# EAGLE design ST40-JTAG (EAGLE 6.5.0)
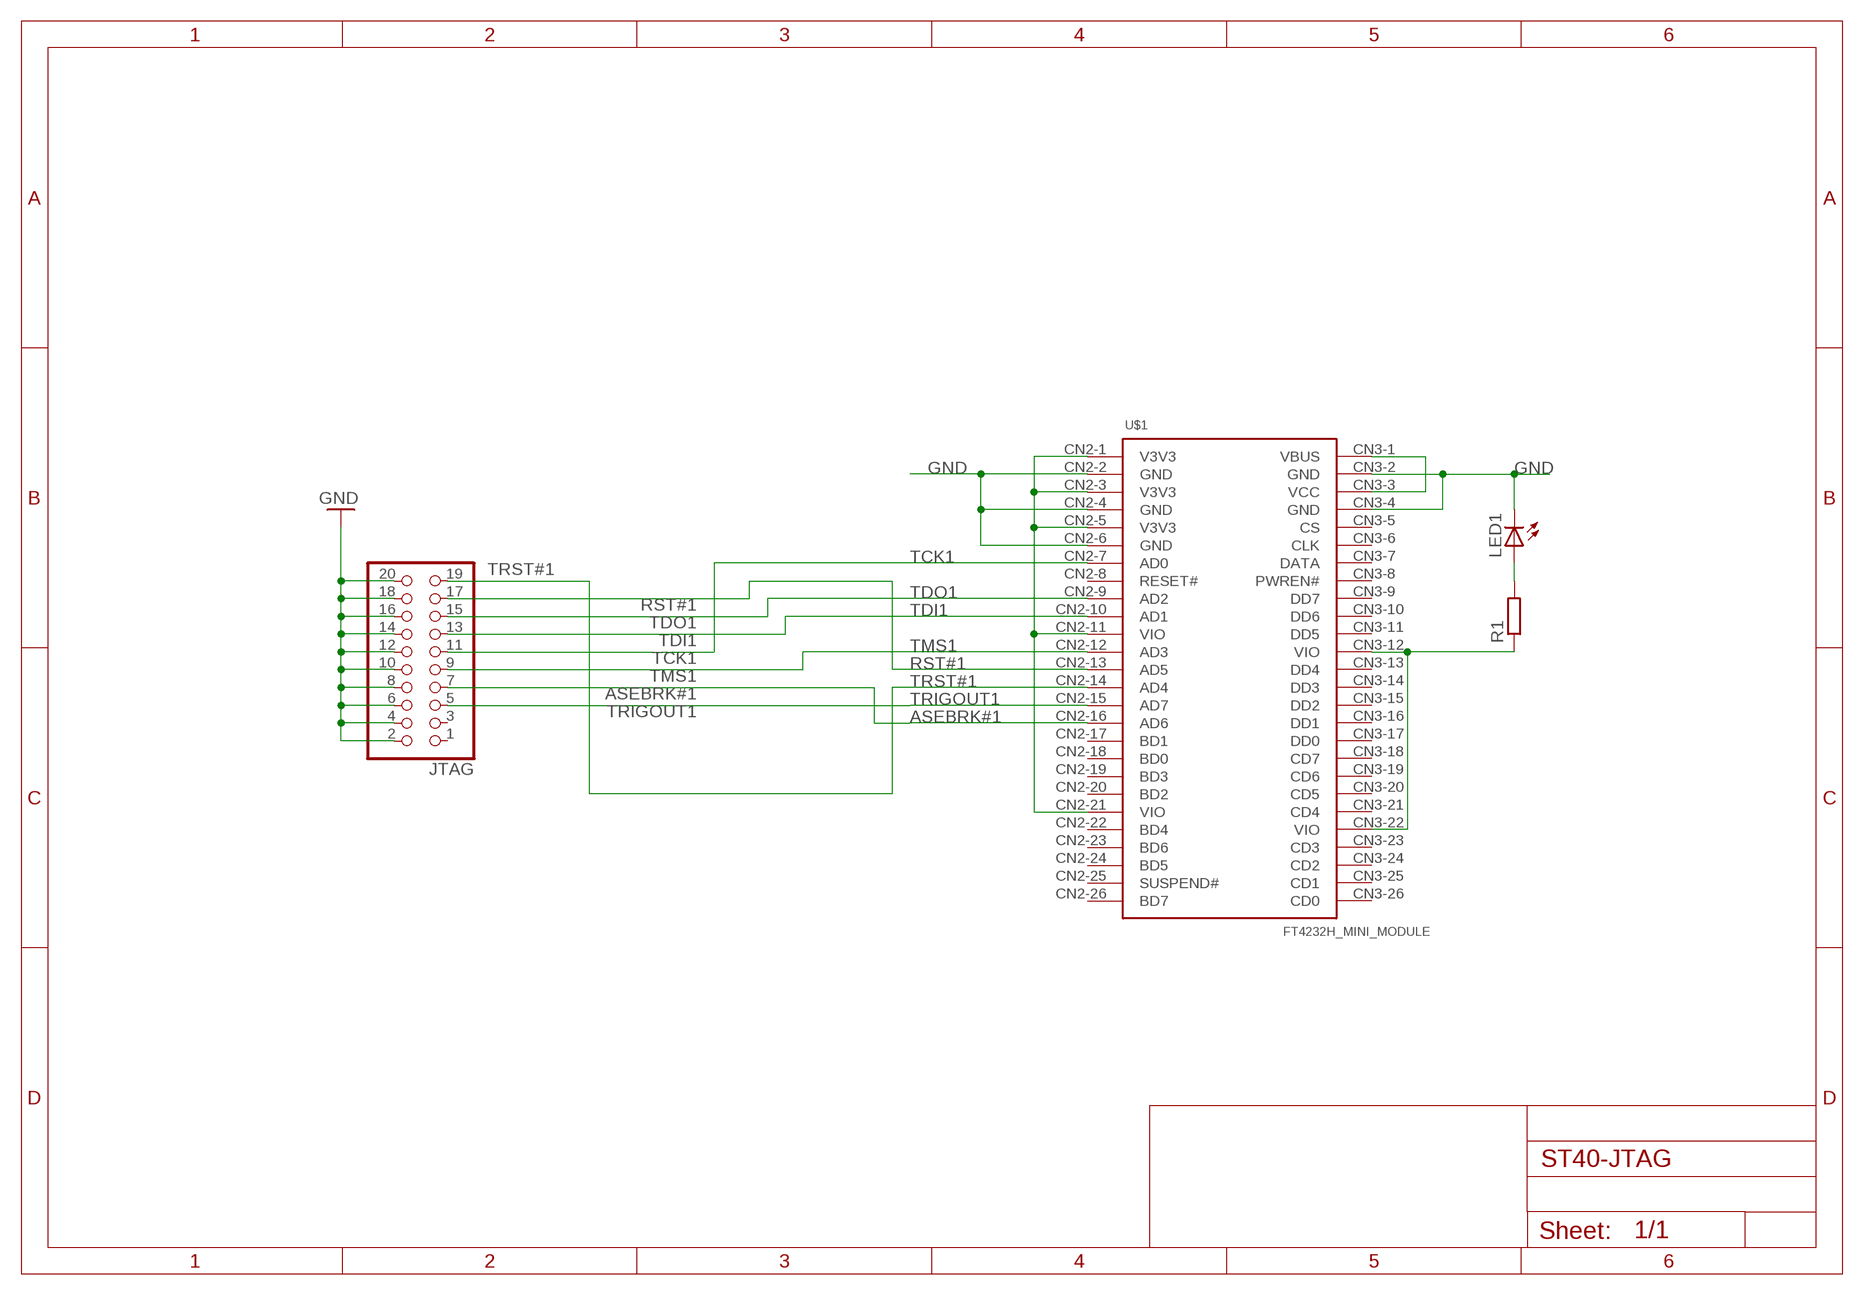
[diagram p0: schematic, sheet 1]

## Parts
JTAG  PINHD-2X10  [2X10]
LED1  LED1206  [LED-1206]
R1  R-EU_M0805  [M0805]
U$1  FT4232H_MINI_MODULE  [PINHEAD]

## Nets
ASEBRK#1: JTAG.7 U$1.CN2-16(AD6)
GND: JTAG.2 JTAG.4 JTAG.6 JTAG.8 JTAG.10 JTAG.12 JTAG.14 JTAG.16 JTAG.18 JTAG.20 LED1.C U$1.CN2-2(GND) U$1.CN2-4(GND) U$1.CN2-6(GND) U$1.CN3-2(GND) U$1.CN3-4(GND)
N$1: U$1.CN3-1(VBUS) U$1.CN3-3(VCC)
N$2: U$1.CN2-1(V3V3) U$1.CN2-3(V3V3) U$1.CN2-5(V3V3) U$1.CN2-11(VIO)
N$3: R1.1 U$1.CN3-12(VIO) U$1.CN3-22(VIO)
N$4: LED1.A R1.2
RST#1: JTAG.17 U$1.CN2-13(AD5)
TCK1: JTAG.11 U$1.CN2-7(AD0)
TDI1: JTAG.13 U$1.CN2-10(AD1)
TDO1: JTAG.15 U$1.CN2-9(AD2)
TMS1: JTAG.9 U$1.CN2-12(AD3)
TRIGOUT1: JTAG.5 U$1.CN2-15(AD7)
TRST#1: JTAG.19 U$1.CN2-14(AD4)
Unconnected: JTAG.1 JTAG.3 U$1.CN2-8(RESET#) U$1.CN2-17(BD1) U$1.CN2-18(BD0) U$1.CN2-19(BD3) U$1.CN2-20(BD2) U$1.CN2-21(VIO) U$1.CN2-22(BD4) U$1.CN2-23(BD6) U$1.CN2-24(BD5) U$1.CN2-25(SUSPEND#) U$1.CN2-26(BD7) U$1.CN3-5(CS) U$1.CN3-6(CLK) U$1.CN3-7(DATA) U$1.CN3-8(PWREN#) U$1.CN3-9(DD7) U$1.CN3-10(DD6) U$1.CN3-11(DD5) U$1.CN3-13(DD4) U$1.CN3-14(DD3) U$1.CN3-15(DD2) U$1.CN3-16(DD1) U$1.CN3-17(DD0) U$1.CN3-18(CD7) U$1.CN3-19(CD6) U$1.CN3-20(CD5) U$1.CN3-21(CD4) U$1.CN3-23(CD3) U$1.CN3-24(CD2) U$1.CN3-25(CD1) U$1.CN3-26(CD0)

## Library data of the parts
JTAG = pinhead:PINHD-2X10: PIN HEADER
LED1 = SparkFun-LED:LED: LEDs Standard schematic elements and footprints for 5mm, 3mm, 1206, and 0603 sized LEDs. 5mm - Spark Fun Electronics SKU : COM-00529 (and others)
R1 = resistor:R-EU_: RESISTOR, European symbol
U$1 = ft4232H_mini_module:FT4232H_MINI_MODULE

## Board
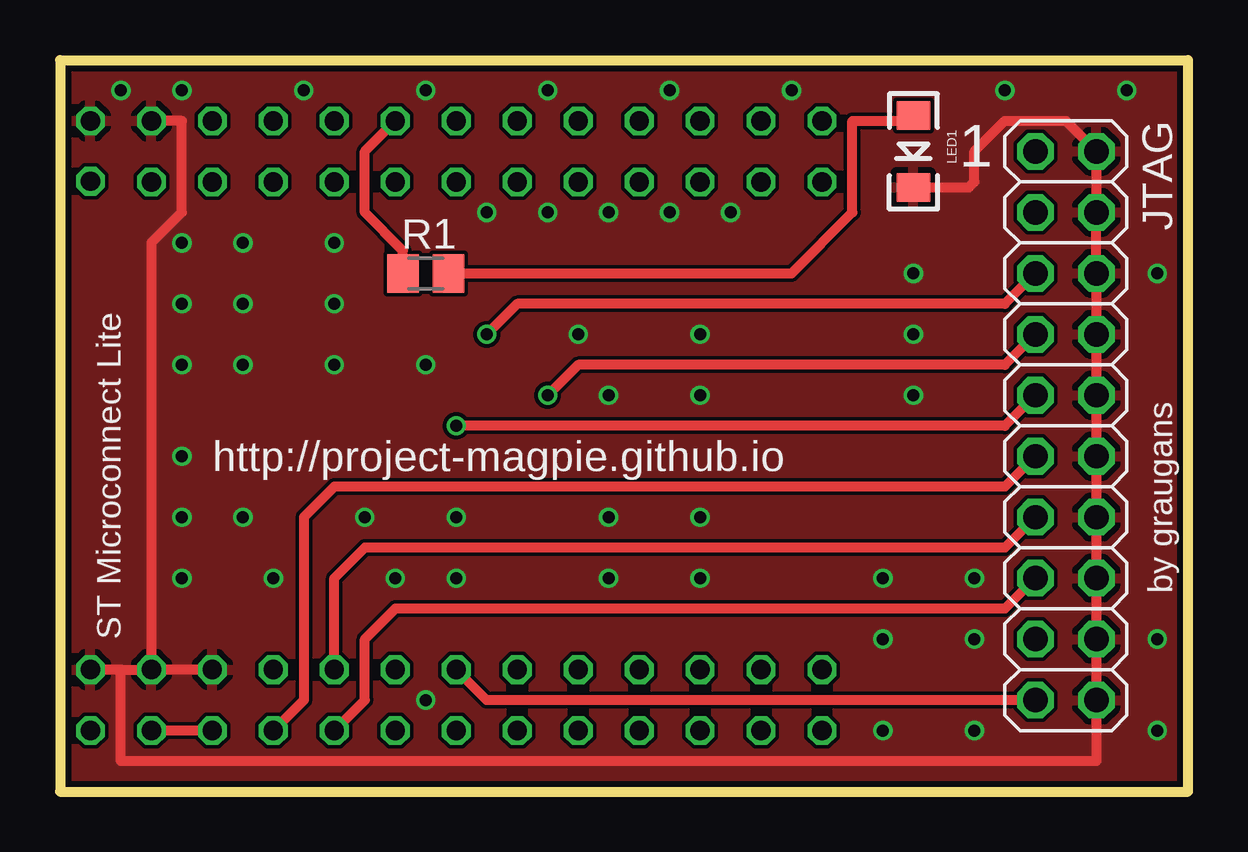
[diagram p1: board, top side]
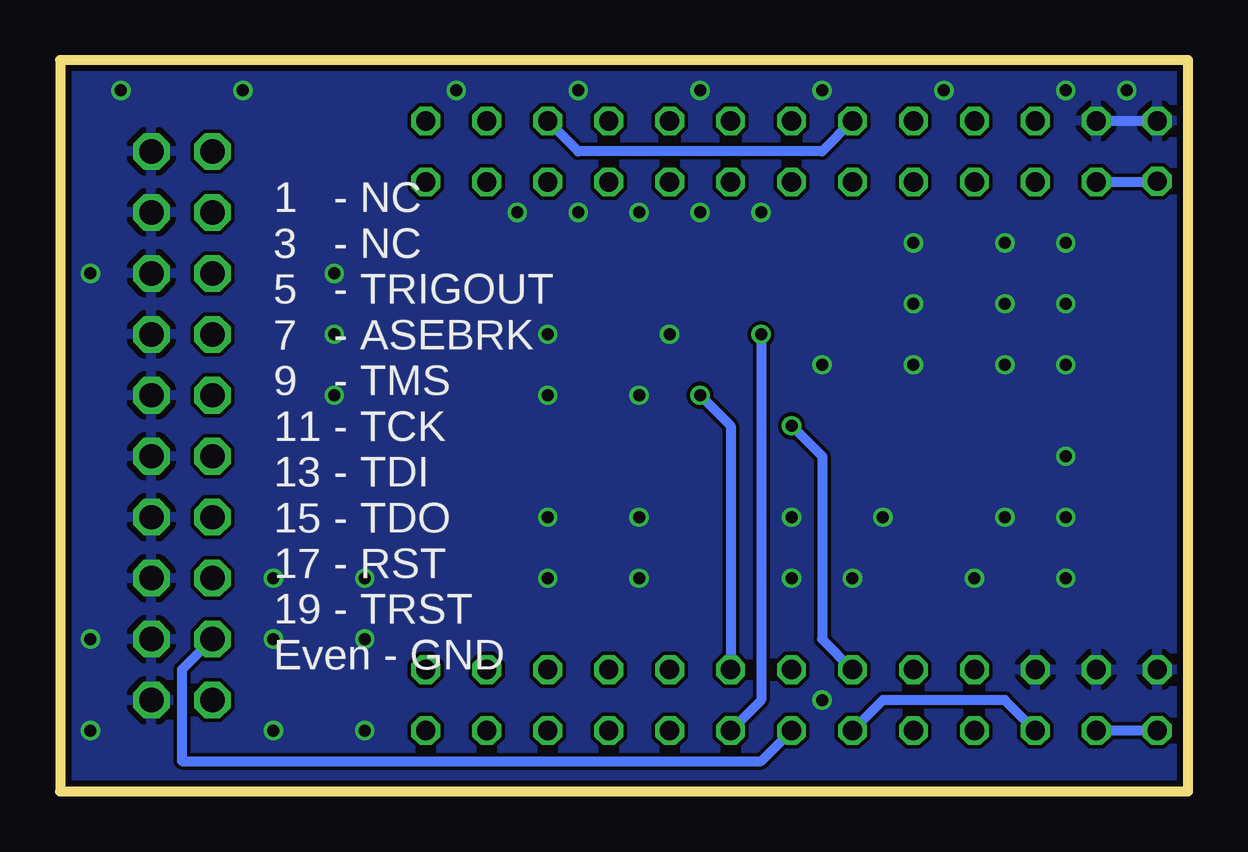
[diagram p2: board, bottom side, seen from below]

Size 46.99 x 30.48 mm. Coordinates in mm from the lower left corner, seen from the top.
Outline: 0,30.48 0,0 46.99,0 46.99,30.48 0,30.48
Copper layers (1*2*15*16): Top 0.035mm / dielectric 0.2mm / Route2 0.0175mm / dielectric 1.1mm / Route15 0.0175mm / dielectric 0.2mm / Bottom 0.035mm
Design rules "SeeedStudio_DRU_no_angle_20130527": minimum track width 6mil, minimum drill 12mil, track to track 6mil, track to pad 6mil, pad to pad 6mil, via to via 6mil, smd to smd 0mil, copper to edge 10mil, drill to drill 10mil, minimum pad ring 6mil, minimum via ring 6mil, stop-mask expansion 2mil, vias tented up to drill 25mil, thermal gap 10mil

### Footprints (pad centres in the part's own frame; a part is rotated, then mirrored left to right if it is on the bottom)
2X10 = drill 1.016 octagon: 1 -11.43,-1.27; 2 -11.43,1.27; 3 -8.89,-1.27; 4 -8.89,1.27; 5 -6.35,-1.27; 6 -6.35,1.27; 7 -3.81,-1.27; 8 -3.81,1.27; 9 -1.27,-1.27; 10 -1.27,1.27; 11 1.27,-1.27; 12 1.27,1.27; 13 3.81,-1.27; 14 3.81,1.27; 15 6.35,-1.27; 16 6.35,1.27; 17 8.89,-1.27; 18 8.89,1.27; 19 11.43,-1.27; 20 11.43,1.27
LED-1206 = smd 1.2 x 1.4: A -1.5,0; C 1.5,0
M0805 = smd 1.3 x 1.6: 1 -0.95,0; 2 0.95,0
PINHEAD = drill 0.8 octagon: CN2-1 -12.7,12.7; CN2-2 -10.16,12.7; CN2-3 -12.7,10.16; CN2-4 -10.16,10.16; CN2-5 -12.7,7.62; CN2-6 -10.16,7.62; CN2-7 -12.7,5.08; CN2-8 -10.16,5.08; CN2-9 -12.7,2.54; CN2-10 -10.16,2.54; CN2-11 -12.7,0; CN2-12 -10.16,0; CN2-13 -12.7,-2.54; CN2-14 -10.16,-2.54; CN2-15 -12.7,-5.08; CN2-16 -10.16,-5.08; CN2-17 -12.7,-7.62; CN2-18 -10.16,-7.62; CN2-19 -12.7,-10.16; CN2-20 -10.16,-10.16; CN2-21 -12.7,-12.7; CN2-22 -10.16,-12.7; CN2-23 -12.7,-15.24; CN2-24 -10.16,-15.24; CN2-25 -12.7,-17.78; CN2-26 -10.16,-17.78; CN3-1 10.19,12.7; CN3-2 12.7,12.7; CN3-3 10.16,10.16; CN3-4 12.7,10.16; CN3-5 10.16,7.62; CN3-6 12.7,7.62; CN3-7 10.16,5.08; CN3-8 12.7,5.08; CN3-9 10.16,2.54; CN3-10 12.7,2.54; CN3-11 10.16,0; CN3-12 12.7,0; CN3-13 10.16,-2.54; CN3-14 12.7,-2.54; CN3-15 10.16,-5.08; CN3-16 12.7,-5.08; CN3-17 10.16,-7.62; CN3-18 12.7,-7.62; CN3-19 10.16,-10.16; CN3-20 12.7,-10.16; CN3-21 10.16,-12.7; CN3-22 12.7,-12.7; CN3-23 10.16,-15.24; CN3-24 12.7,-15.24; CN3-25 10.16,-17.78; CN3-26 12.7,-17.78

### Placement (x,y rotation side)
JTAG  41.91,15.24 270 top
LED1  35.56,26.67 270 top
R1  15.24,21.59 0 top
U$1  13.97,15.24 90 top

### Tracks (layer width: path | path; a pad name or v marks a point on that pad's centre or on a via)
ASEBRK#1  (via drill 0.5)
  Top 0.406: JTAG.7 39.37,17.78 21.59,17.78 v20.32,16.51
  Bottom 0.406: v20.32,16.51 19.05,15.24 U$1.CN2-16
GND  (via drill 0.5)
  Top 0.406: U$1.CN3-4 5.08,27.94 5.08,24.13 3.81,22.86 U$1.CN2-4 | JTAG.18 JTAG.20 | JTAG.18 JTAG.16 JTAG.14 JTAG.12 JTAG.10 JTAG.8 JTAG.6 JTAG.4 JTAG.2 41.91,27.94 39.37,27.94 38.1,26.67 38.1,25.4 37.87,25.17 LED1.C | JTAG.18 43.18,1.27 2.54,1.27 2.54,5.08 | U$1.CN2-6 U$1.CN2-4 | 2.54,5.08 U$1.CN2-4 | 2.54,5.08 U$1.CN2-2
  Bottom 0.406: U$1.CN3-4 U$1.CN3-2
  other vias: 2.54,29.21 5.08,29.21 10.16,29.21 15.24,29.21 20.32,29.21 25.4,29.21 30.48,29.21 39.37,29.21 44.45,29.21 45.72,21.59 45.72,6.35 45.72,2.54 38.1,6.35 34.29,6.35 38.1,8.89 34.29,8.89 26.67,8.89 26.67,11.43 26.67,16.51 35.56,16.51 35.56,19.05 35.56,21.59 21.59,19.05 22.86,16.51 22.86,11.43 22.86,8.89 34.29,2.54 38.1,2.54 8.89,8.89 5.08,8.89 5.08,11.43 7.62,11.43 15.24,17.78 11.43,17.78 7.62,17.78 5.08,17.78 5.08,20.32 7.62,20.32 11.43,20.32 11.43,22.86 7.62,22.86 5.08,22.86 5.08,13.97 17.78,24.13 20.32,24.13 22.86,24.13 25.4,24.13 27.94,24.13 12.7,11.43 13.97,8.89 15.24,3.81 26.67,19.05 16.51,11.43 16.51,8.89
  pour Top: 0,30.48 0,0 46.99,0 46.99,30.48
  pour Bottom: 0,30.48 46.99,30.48 46.99,0 0,0
N$1
  Bottom 0.406: U$1.CN3-3 1.3,25.4 U$1.CN3-1
N$2
  Top 0.406: U$1.CN2-5 U$1.CN2-3
  Bottom 0.406: U$1.CN2-1 U$1.CN2-3 | U$1.CN2-5 7.62,3.81 12.7,3.81 U$1.CN2-11
N$3
  Top 0.406: R1.1 14.29,22.54 12.7,24.13 12.7,26.67 U$1.CN3-12
  Bottom 0.406: U$1.CN3-12 15.24,26.67 25.4,26.67 U$1.CN3-22
N$4
  Top 0.406: R1.2 30.48,21.59 33.02,24.13 33.02,27.94 35.33,27.94 LED1.A
RST#1
  Bottom 0.406: JTAG.17 41.91,5.08 41.91,1.27 17.78,1.27 U$1.CN2-13
TCK1
  Top 0.406: JTAG.11 39.37,12.7 11.43,12.7 10.16,11.43 10.16,3.81 U$1.CN2-7
TDI1
  Top 0.406: JTAG.13 39.37,10.16 12.7,10.16 11.43,8.89 U$1.CN2-10
TDO1
  Top 0.406: JTAG.15 39.37,7.62 13.97,7.62 12.7,6.35 12.7,3.81 U$1.CN2-9
TMS1  (via drill 0.5)
  Top 0.406: JTAG.9 39.37,15.24 v16.51,15.24
  Bottom 0.406: v16.51,15.24 15.24,13.97 15.24,6.35 U$1.CN2-12
TRIGOUT1  (via drill 0.5)
  Top 0.406: JTAG.5 39.37,20.32 19.05,20.32 v17.78,19.05
  Bottom 0.406: v17.78,19.05 17.78,3.81 U$1.CN2-15
TRST#1
  Top 0.406: JTAG.19 17.78,3.81 U$1.CN2-14

### Text on the board
tPlace: 1 | http://project-magpie.github.io | by graugans | ST Microconnect Lite
bPlace: 1 - NC / 3 - NC / 5 - TRIGOUT / 7 - ASEBRK / 9 - TMS / 11 - TCK / 13 - TDI / 15 - TDO / 17 - RST / 19 - TRST / Even - GND